# EasyEDA schematic 02-AXP2101.json
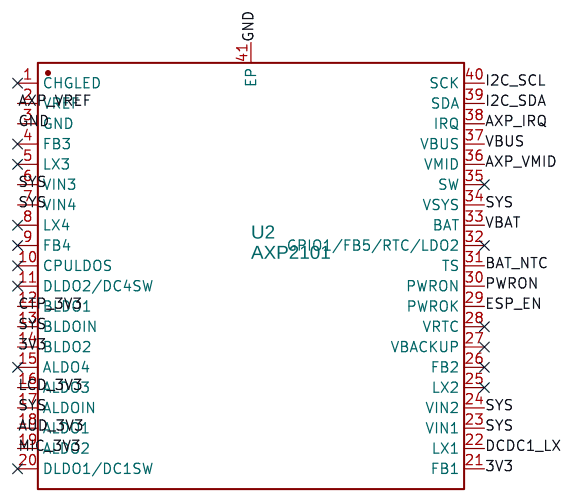
[diagram p0: schematic sheet]

## Parts
U2  AXP2101  [QFN-40_L5.0-W5.0-P0.40-TL-EP3.4]

## Library data of the parts
U2 = -: Contributor: lcsc; Supplier: LCSC; Supplier Part: C3036461; Manufacturer: x-powers(); JLCPCB Part Class: Extended Part

## Nets
3V3: U2.14(BLDO2) U2.21(FB1)
GND: U2.3(GND) U2.41(EP)
VBAT: U2.33(BAT)
VBUS: U2.37(VBUS)
AUD_3V3: U2.18(ALDO1)
AXP_IRQ: U2.38(IRQ)
AXP_VMID: U2.36(VMID)
AXP_VREF: U2.2(VREF)
BAT_NTC: U2.31(TS)
CTP_3V3: U2.12(BLDO1)
DCDC1_LX: U2.22(LX1)
ESP_EN: U2.29(PWROK)
I2C_SCL: U2.40(SCK)
I2C_SDA: U2.39(SDA)
LCD_3V3: U2.16(ALDO3)
MIC_3V3: U2.19(ALDO2)
PWRON: U2.30(PWRON)
SYS: U2.6(VIN3) U2.7(VIN4) U2.13(BLDOIN) U2.17(ALDOIN) U2.23(VIN1) U2.24(VIN2) U2.34(VSYS)

Not connected (* = marked no-connect by the designer): U2 1(CHGLED)* 4(FB3)* 5(LX3)* 8(LX4)* 9(FB4)* 10(CPULDOS)* 11(DLDO2/DC4SW)* 15(ALDO4)* 20(DLDO1/DC1SW)* 25(LX2)* 26(FB2)* 27(VBACKUP)* 28(VRTC)* 32(GPIO1/FB5/RTC/LDO2)* 35(SW)*

## Notes on the sheet
- MEB AI Asistan - 2/5  AXP2101 guc
- DCDC1 -> 3V3 (ESP32). ALDO1 ses, ALDO2 mik, ALDO3 LCD, BLDO1 dokunma.
- Bobin/kapasitorleri AXP2101 typical application ile sonraki adimda. Net isimleri kilitli.
- PWRON: power tusu (GND). VBAT: Li-Po. VBUS: Type-C. PWROK -> ESP_EN.
